# Altium project RFM300EVB.PrjPCB
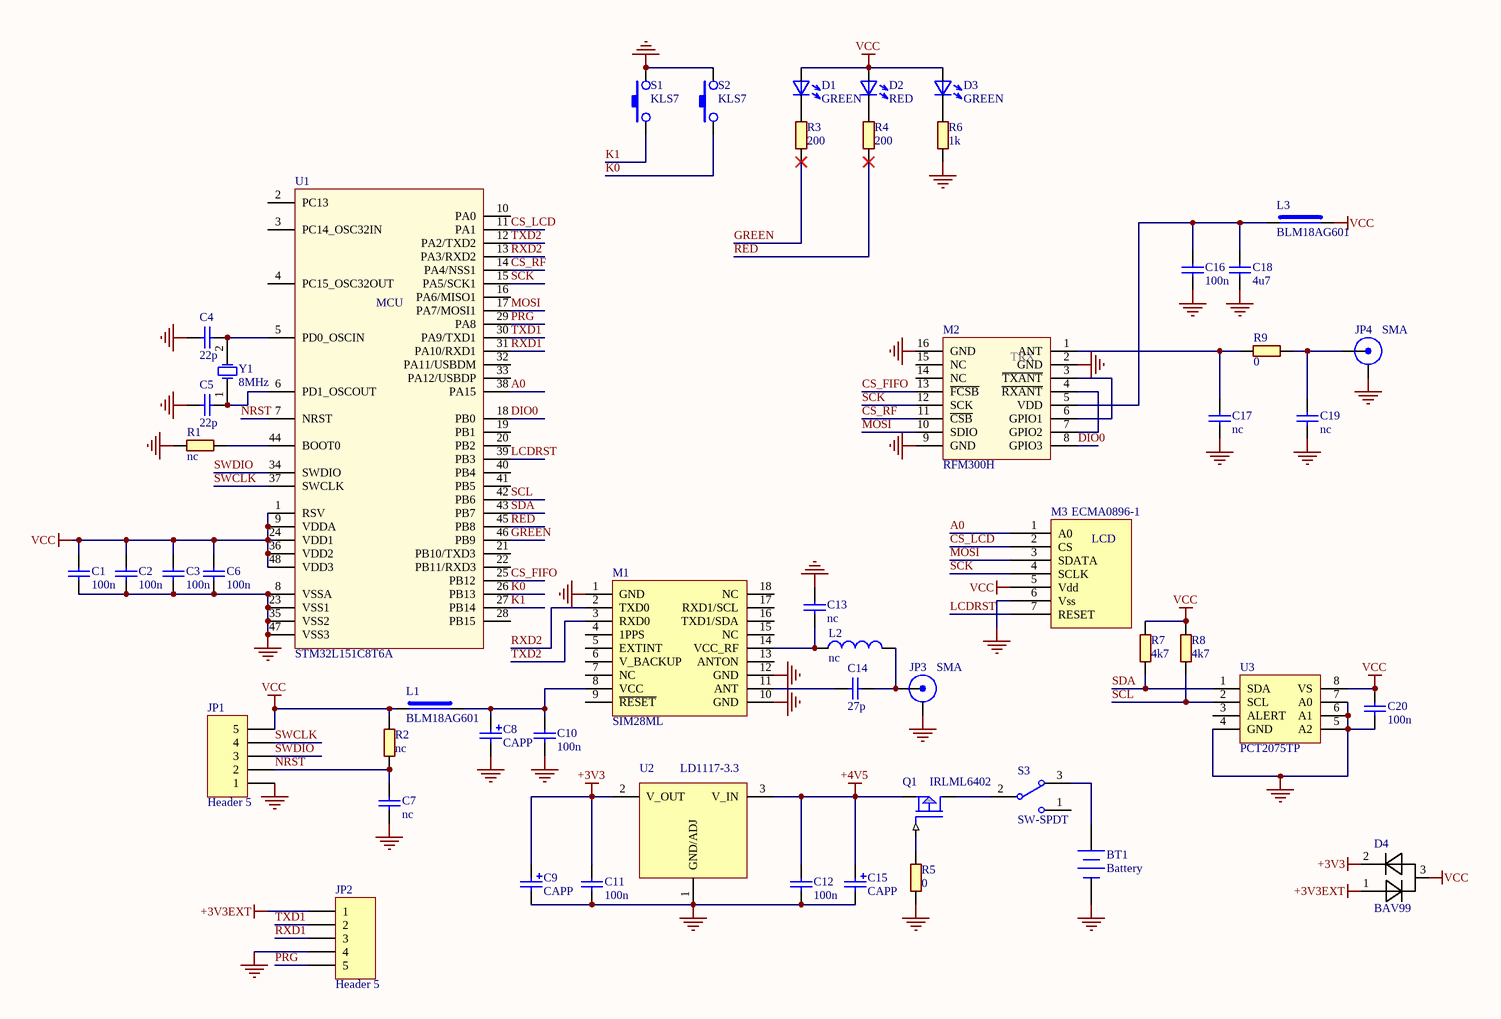
[diagram p0: RFM300HEVB_V01.SchDoc]
1 sheet, 52 parts. Net scope: global (net labels, ports and power ports of the same name join across sheets).
Board file: RFM300HEVB_V01.PcbDoc

## Sheet RFM300HEVB_V01.SchDoc
size 420 x 297 mm; Scale: {Масш.}; Title1str: {Наименование}; PageSetup: Record=PageOptions|CenterHorizontal=False|CenterVertical=False|PrintScale=0.95|XCorrection=0.00|YCorrection=0.00|PrintKind=1|BorderSize=5000000|LeftOffset=0|BottomOffset=0|Orientation=1|PaperLength=1000|PaperWidth=1000|Scale=100|PaperSource=15|PrintQuality=600|MediaType=1|DitherType=10|PaperKind=A4|PrintScaleMode=1; Title2str: {Наименование}; ProcessInspection: {Т.контр.}; Mass: {Масса}; NormInspection: {Н.контр.}; EngineerName: {Инженер}; Letter1Column: {}; Letter2Column: {}; Letter3Column: {}; DocumentType: {Документ}; DocumentType1str: {Документ}; DocumentType2str: {Документ}

### Parts
BT1  Battery  [3AAAHOLDER]
C1  100n  [C-0603]
C2  100n  [C-0603]
C3  100n  [C-0603]
C4  22p  [C-0603]
C5  22p  [C-0603]
C6  100n  [C-0603]
C7  nc  [C-0603]
C8  CAPP  [C-TANTAL-B]
C9  CAPP  [C-TANTAL-B]
C10  100n  [C-0603]
C11  100n  [C-0603]
C12  100n  [C-0603]
C13  nc  [C-0603]
C14  27p  [C-0603]
C15  CAPP  [C-TANTAL-B]
C16  100n  [C-0603]
C17  nc  [C-0603]
C18  4u7  [C-0805]
C19  nc  [C-0603]
C20  100n  [C-0603]
D1  GREEN  [LED_0805]
D2  RED  [LED_0805]
D3  GREEN  [LED_0805]
D4  BAV99  [SOT23]
JP1  Header 5  [PLS1-5R]
JP2  Header 5  [PLS1-5R]
JP3  SMA  [AMPHENOL_132357-11]
JP4  SMA  [AMPHENOL_132357-11]
L1  BLM18AG601  [L-0603]
L2  nc  [L-0603]
L3  BLM18AG601  [L-0603]
M1  SIM28ML  [LGA18_GNSS]
M2  RFM300H  [LGA16C200P2X8_1600X1600X200]
M3  ECMA0896-1  [PLS1-7]
Q1  IRLML6402  [SOT-23]
R1  nc  [R-0603]
R2  nc  [R-0603]
R3  200  [R-0603]
R4  200  [R-0603]
R5  0  [R-0603]
R6  1k  [R-0603]
R7  4k7  [R-0603]
R8  4k7  [R-0603]
R9  0  [R-0603]
S1  KLS7  [KLS7-TS3602]
S2  KLS7  [KLS7-TS3602]
S3  SW-SPDT  [SPDT_100mil]
U1  STM32L151C8T6A  [LQFP-48]
U2  LD1117-3.3  [SOT230P700X180-4N]
U3  PCT2075TP  [SOT1069-2]
Y1  8MHz  [HC49_3.5mm]

### Nets
+3V3: C9.2 C11.1 D4.2 U2.2(V_OUT)
+3V3EXT: D4.1 JP2.1
+4V5: C12.1 C15.2 Q1.2(SOURCE) U2.3(V_IN)
GND: BT1.2(-) C1.2 C2.2 C3.2 C4.1 C5.1 C6.2 C7.2 C8.1 C9.1 C10.2 C11.2 C12.2 C13.1 C15.1 C16.2 C17.2 C18.2 C19.2 C20.2 JP1.1 JP2.4 JP3.2(Y) JP4.2(Y) M1.1(GND) M1.10(GND) M1.12(GND) M2.2(GND) M2.9(GND) M2.16(GND) M3.6(Vss) R1.1 R5.1 R6.2 S1.2 S2.2 U1.8(VSSA) U1.23(VSS1) U1.35(VSS2) U1.47(VSS3) U2.1(GND/ADJ) U3.4(GND) U3.5(A2) U3.6(A1) U3.7(A0)
VCC: C1.1 C2.1 C3.1 C6.1 C20.1 D1.A D2.A D3.A D4.3 JP1.5 L1.1 L3.1 M3.5(Vdd) R2.2 R7.2 R8.2 U1.1(RSV) U1.9(VDDA) U1.24(VDD1) U1.36(VDD2) U1.48(VDD3) U3.8(VS)
A0: M3.1(A0) U1.38(PA15)
CS_FIFO: M2.13(~{FCSB}) U1.25(PB12)
CS_LCD: M3.2(CS) U1.11(PA1)
CS_RF: M2.11(~{CSB}) U1.14(PA4/NSS1)
DIO0: M2.8(GPIO3) U1.18(PB0)
GREEN: R3.2 U1.46(PB9)
K0: S2.1 U1.26(PB13)
K1: S1.1 U1.27(PB14)
LCDRST: M3.7(RESET) U1.39(PB3)
MOSI: M2.10(SDIO) M3.3(SDATA) U1.17(PA7/MOSI1)
NRST: C7.1 JP1.2 R2.1 U1.7(NRST)
PRG: JP2.5 U1.29(PA8)
RED: R4.2 U1.45(PB8)
RXD1: JP2.3 U1.31(PA10/RXD1)
RXD2: M1.2(TXD0) U1.13(PA3/RXD2)
SCK: M2.12(SCK) M3.4(SCLK) U1.15(PA5/SCK1)
SCL: R8.1 U1.42(PB6) U3.2(SCL)
SDA: R7.1 U1.43(PB7) U3.1(SDA)
SWCLK: JP1.4 U1.37(SWCLK)
SWDIO: JP1.3 U1.34(SWDIO)
TXD1: JP2.2 U1.30(PA9/TXD1)
TXD2: M1.3(RXD0) U1.12(PA2/TXD2)
NetBT1_1: BT1.1(+) S3.3
NetC4_2: C4.2 U1.5(PD0_OSCIN) Y1.2(OSC2)
NetC5_2: C5.2 U1.6(PD1_OSCOUT) Y1.1(OSC1)
NetC8_2: C8.2 C10.1 L1.2 M1.8(VCC)
NetC13_2: C13.2 L2.1 M1.14(VCC_RF)
NetC14_1: C14.1 M1.11(ANT)
NetC14_2: C14.2 JP3.1(X) L2.2
NetC16_1: C16.1 C18.1 L3.2 M2.5(VDD)
NetC17_1: C17.1 M2.1(ANT) R9.1
NetC19_1: C19.1 JP4.1(X) R9.2
NetD1_K: D1.K R3.1
NetD2_K: D2.K R4.1
NetD3_K: D3.K R6.1
NetM2_3: M2.3(~{TXANT}) M2.6(GPIO1)
NetM2_4: M2.4(~{RXANT}) M2.7(GPIO2)
NetQ1_1: Q1.1(GATE) R5.2
NetQ1_3: Q1.3(DRAIN) S3.2
NetR1_2: R1.2 U1.44(BOOT0)

Not connected (* = marked no-connect by the designer): M1 4(1PPS) 5(EXTINT) 6(V_BACKUP) 7(NC) 9(~{RESET}) 13(ANTON) 15(NC) 16(TXD1/SDA) 17(RXD1/SCL) 18(NC); M2 14(NC) 15(NC); S3 1; U1 2(PC13) 3(PC14_OSC32IN) 4(PC15_OSC32OUT) 10(PA0) 16(PA6/MISO1) 19(PB1) 20(PB2) 21(PB10/TXD3) 22(PB11/RXD3) 28(PB15) 32(PA11/USBDM) 33(PA12/USBDP) 40(PB4) 41(PB5); U3 3(ALERT)

### Notes on the sheet
- Перв. примен.
- Справ. №
- Подп. и дата
- Инв. № дубл.
- Взам. инв. №
- Изм.
- Лист
- № докум.
- Подп.
- Дата
- Лит.
- Масса
- Масштаб
- Т.контр.
- Пров.
- Разраб.
- Листов
- Инв. № подл.
- Н.контр.
- Утв.
- Копировал
- Формат А3
- (in symbol ECMA0896) LCD
- (in symbol RFM300H) TRX
- (in symbol STM32L151C8T6) MCU

### Library data of the parts
BT1 = Battery: Multicell Battery; Published: 24-Mar-1999; LatestRevisionDate: 17-Jul-2002; LatestRevisionNote: Re-released for DXP Platform.; PackageReference: BAT-2; Publisher: Altium Limited; PackageDescription: Battery; 2 Leads
C1-C7 C10-C14 C16-C20 = CAPN
D1-D3 = DLED
D4 = BAV99: High-speed switching diodes 0.215 AMPERES, 100 VOLTS, Cjmax=2pF, SOT-23; Позиційне позначення на платі: D4; Name: BAV99; Корпус: SOT23; Номінал: BAV99
JP1 JP2 = Header 5: Header, 5-Pin; LatestRevisionDate: 17-Jul-2002; LatestRevisionNote: Re-released for DXP Platform.; Publisher: Altium Limited
JP3 JP4 = X-004: RF Connector; Производитель: *; Допустимая замена: *; Цена: *; PDF файл: *; Температурный диапазон: *; Описание пользователя: *; Конфигурация контактов RxNN: *; *: *
L1 L3 = SUPRESOR: Примечание: *; Производитель: *
L2 = L
M3 = ECMA0896
R1-R9 = RES
S1 S2 = SW-1: Вид: Кнопка; Производитель: *; Описание пользователя: *; *: *; Корпус: =Footprint; Тип: KLS7
S3 = SW-SPDT: SPDT Subminiature Toggle Switch, Right Angle Mounting, Vertical Actuation; Published: 24-Mar-1999; LatestRevisionDate: 17-Dec-2003; LatestRevisionNote: Schematic revised, PCB Footprint replaced.; DatasheetVersion: 05-Dec-2000; PackageReference: TL36WW15050; Publisher: Altium Limited; PackageDescription: Switch; 4 Leads; ComponentLink1Description: Manufacturer Link; ComponentLink1URL: http://www.apem.com
U1 = STM32L151C8T6
U2 = LM1117_3.3: Вид: Мікросхема; Тип: LD1117-3.3; Корпус: =Footprint
U3 = TMP75: Part Field 1: NXP; Part Field 6: I2C Digital temperature sensor
Y1 = XTAL: Crystal Oscillator; Published: 8-Jun-2000; LatestRevisionDate: 17-Jul-2002; LatestRevisionNote: Re-released for DXP Platform.; PackageReference: R38; Publisher: Altium Limited; PackageDescription: Crystal, Thru-Hole; 2 Leads; Body 3.1 x 8.2 mm (Dia.xH)